# Altium schematic sheet POS.SchDoc
size A4; SheetNumber: 9; SheetTotal: 12
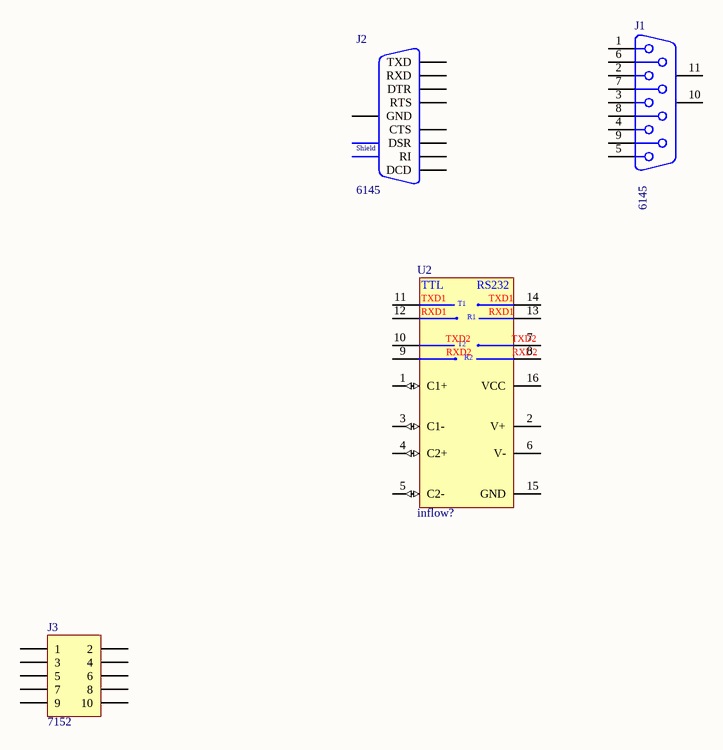
[diagram p0: POS.SchDoc]

## Parts
J1  Inflow: 6145  [DB9 Female]  (hidden comment: RS232)
J2  Inflow: 6145  [DB9 Male]  (hidden comment: RS232)
J3  Inflow: 7152  [HDR_THT_5x2M_2.54mm]  (hidden comment: 5x2)
U2  Inflow: inflow?  [NSO16_M]  (hidden comment: MAX3232)

## Nets

Not connected (* = marked no-connect by the designer): J1 1 2 3 4 5 6 7 8 9 10(MH1) 11(MH2); J2 1(DCD) 2(RXD) 3(TXD) 4(DTR) 5(GND) 6(DSR) 7(RTS) 8(CTS) 9(RI) 10(MH1) 11(MH2); J3 1 2 3 4 5 6 7 8 9 10; U2 1(C1+) 2(V+) 3(C1-) 4(C2+) 5(C2-) 6(V-) 7(T2OUT) 8(R2IN) 9(R2OUT) 10(T2IN) 11(T1IN) 12(R1OUT) 13(R1IN) 14(T1OUT) 15(GND) 16(VCC)

## Notes on the sheet
- (in symbol Con_PC_RS232) Shield
- (in symbol IC_Converter_MAX3232CSE) TTL; TXD1; T1; RXD1; R1; TXD2; T2; RXD2; R2

## Library data of the parts
J1 = Con_PC_DB9: Receptacle Assembly, 9 Position, Right Angle RS232 (COM); Rating: Rating?; Validation: Valid; Value: RS232; Package: DB9; Type: Type?
J2 = Con_PC_RS232: Receptacle Assembly, 9 Position, Right Angle RS232 (COM); Rating: Rating?; Validation: NT; Value: RS232; Package: Package?; Type: Type?
J3 = Con_MPH_5x2_V_THT_2.54: Header, dual row, 10 pin; Rating: Rating?; Validation: NT; Value: 5x2; Package: Package?; Type: Type?
U2 = IC_Converter_MAX3232CSE: RS-232 Interface IC 3.0V to 5.5V, Low-Power, up to 1Mbps, True RS-232 Transceivers Using Four 0.1uF External Capacitors; Rating: Rating?; Validation: Valid; Value: MAX3232; Package: SOIC-16; Type: RS232